# EAGLE design WirelessScale (EAGLE 5.10)
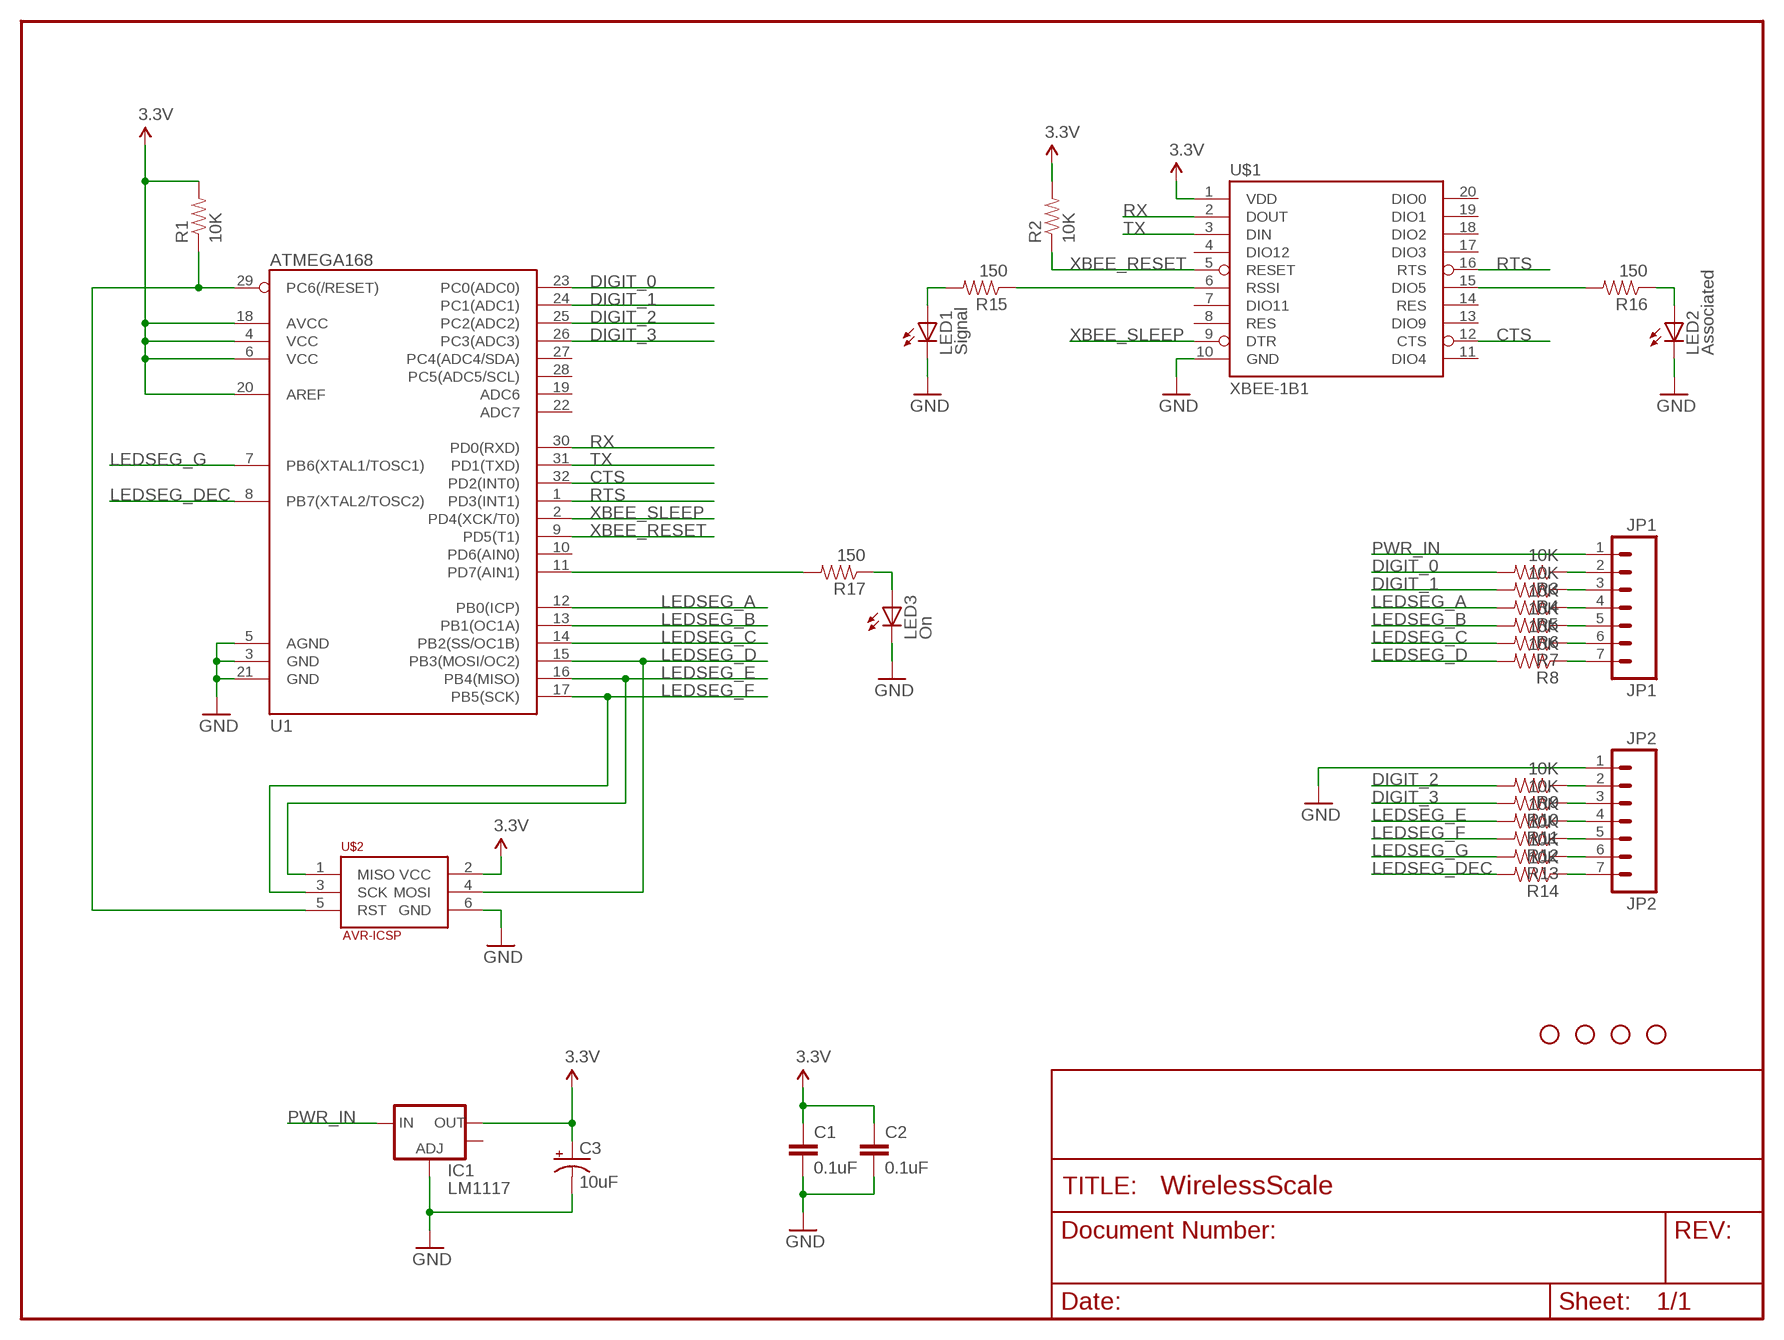
[diagram p0: schematic, sheet 1]

## Parts
C1  0.1uF  CAP1206  [1206]
C2  0.1uF  CAP1206  [1206]
C3  10uF  CAP_POLPTH2  [CPOL-RADIAL-10UF-25V]
IC1  LM1117  V_REG_LM1117SOT223  [SOT223]
JP1  JP1  M07  [1X07]
JP2  JP2  M07  [1X07]
JP3  STAND-OFF  [STAND-OFF]
JP4  STAND-OFF  [STAND-OFF]
JP5  STAND-OFF  [STAND-OFF]
JP6  STAND-OFF  [STAND-OFF]
LED1  Signal  LED1206  [LED-1206]
LED2  Associated  LED1206  [LED-1206]
LED3  On  LED1206  [LED-1206]
R1  10K  RESISTOR1206  [1206]
R2  10K  RESISTOR1206  [1206]
R3  10K  RESISTOR1206  [1206]
R4  10K  RESISTOR1206  [1206]
R5  10K  RESISTOR1206  [1206]
R6  10K  RESISTOR1206  [1206]
R7  10K  RESISTOR1206  [1206]
R8  10K  RESISTOR1206  [1206]
R9  10K  RESISTOR1206  [1206]
R10  10K  RESISTOR1206  [1206]
R11  10K  RESISTOR1206  [1206]
R12  10K  RESISTOR1206  [1206]
R13  10K  RESISTOR1206  [1206]
R14  10K  RESISTOR1206  [1206]
R15  150  RESISTOR1206  [1206]
R16  150  RESISTOR1206  [1206]
R17  150  RESISTOR1206  [1206]
U1  ATMEGA168  [TQFP32-08]
U$1  XBEE-1B1  [XBEE-1]
U$2  AVR-ICSP  [AVR-ICSP]

## Nets
3.3V: C1.1 C2.1 C3.1(+) IC1.2(OUT) R1.2 R2.2 U1.4(VCC) U1.6(VCC) U1.18(AVCC) U1.20(AREF) U$1.1(VDD) U$2.2(VCC)
CTS: U1.32(PD2(INT0)) U$1.12(CTS)
DIGIT_0: R3.2 U1.23(PC0(ADC0))
DIGIT_1: R4.2 U1.24(PC1(ADC1))
DIGIT_2: R9.2 U1.25(PC2(ADC2))
DIGIT_3: R10.2 U1.26(PC3(ADC3))
GND: C1.2 C2.2 C3.2(-) IC1.1(ADJ) JP2.1 LED1.C LED2.C LED3.C U1.3(GND) U1.5(AGND) U1.21(GND) U$1.10(GND) U$2.6(GND)
LEDSEG_A: R5.2 U1.12(PB0(ICP))
LEDSEG_B: R6.2 U1.13(PB1(OC1A))
LEDSEG_C: R7.2 U1.14(PB2(SS/OC1B))
LEDSEG_D: R8.2 U1.15(PB3(MOSI/OC2)) U$2.4(MOSI)
LEDSEG_DEC: R14.2 U1.8(PB7(XTAL2/TOSC2))
LEDSEG_E: R11.2 U1.16(PB4(MISO)) U$2.1(MISO)
LEDSEG_F: R12.2 U1.17(PB5(SCK)) U$2.3(SCK)
LEDSEG_G: R13.2 U1.7(PB6(XTAL1/TOSC1))
N$1: R15.1 U$1.6(RSSI)
N$2: R1.1 U1.29(PC6(/RESET)) U$2.5(RST)
N$3: LED1.A R15.2
N$4: JP2.2 R9.1
N$5: JP2.3 R10.1
N$6: JP2.4 R11.1
N$7: JP2.5 R12.1
N$8: R16.2 U$1.15(DIO5)
N$9: JP2.6 R13.1
N$10: JP2.7 R14.1
N$11: JP1.2 R3.1
N$12: JP1.3 R4.1
N$13: JP1.4 R5.1
N$14: JP1.5 R6.1
N$15: JP1.6 R7.1
N$16: JP1.7 R8.1
N$17: LED2.A R16.1
N$19: LED3.A R17.1
N$20: R17.2 U1.11(PD7(AIN1))
PWR_IN: IC1.3(IN) JP1.1
RTS: U1.1(PD3(INT1)) U$1.16(RTS)
RX: U1.30(PD0(RXD)) U$1.2(DOUT)
TX: U1.31(PD1(TXD)) U$1.3(DIN)
XBEE_RESET: R2.1 U1.9(PD5(T1)) U$1.5(RESET)
XBEE_SLEEP: U1.2(PD4(XCK/T0)) U$1.9(DTR)
Unconnected: IC1.4(OUT) U1.10(PD6(AIN0)) U1.19(ADC6) U1.22(ADC7) U1.27(PC4(ADC4/SDA)) U1.28(PC5(ADC5/SCL)) U$1.4(DIO12) U$1.7(DIO11) U$1.8(RES) U$1.11(DIO4) U$1.13(DIO9) U$1.14(RES) U$1.17(DIO3) U$1.18(DIO2) U$1.19(DIO1) U$1.20(DIO0)

## Library data of the parts
C1 C2 = SparkFun:CAP: Capacitor Standard 0603 ceramic capacitor, and 0.1" leaded capacitor.
C3 = SparkFun:CAP_POL: Capacitor Polarized These are standard SMD and PTH capacitors. Normally 10uF, 47uF, and 100uF in electrolytic and tantalum varieties. Always verify the external diameter of the through hole cap, it varies with capacity, voltage, and manufacturer. The EIA devices should be standard.
IC1 = SparkFun:V_REG_LM1117: Voltage Regulator LM1117 Standard adjustable voltage regulator but in SMD form. Spark Fun Electronics SKU : COM-00595
JP1 JP2 = SparkFun:M07: Header 7 Standard 7-pin 0.1" header. Use with straight break away headers (SKU : PRT-00116), right angle break away headers (PRT-00553), swiss pins (PRT-00743), machine pins (PRT-00117), and female headers (PRT-00115). NOTES ON THE VARIANTS LOCK and LOCK_LONGPADS... This footprint was designed to help hold the alignment of a through-hole component (i.e. 7-pin header) while soldering it into place. You may notice that each hole has been shifted either up or down by 0.005 of an inch from it's more standard position (which is usually a perfectly straight line). This slight alteration caused the pins (the squares in the middle) to touch the edges of the holes. Because they are alternating, it causes a "brace" to hold the header in place. 0.005 has proven to be the perfect amount of "off-center" position when using our standard breakaway headers. Although looks a little odd when you look at the bare footprint, once you have a header in there, the alteration is very hard to notice. Also, if you push a header all the way into place, it is covered up entirely on the bottom side. This idea of altering the position of holes to aid alignment will be further integrated into the Sparkfun Library for other footprints. It can help hold any component with 3 or more connection pins.
JP3-JP6 = SparkFun:STAND-OFF: Stand Off This is the mechanical footprint for a #4 phillips button head screw. Use the keepout ring to avoid running the screw head into surrounding components. SKU : PRT-00447
LED1-LED3 = SparkFun:LED: LEDs Standard schematic elements and footprints for 5mm, 3mm, 1206, and 0603 sized LEDs. 5mm - Spark Fun Electronics SKU : COM-00529 (and others)
R1-R17 = SparkFun:RESISTOR: Resistor Basic schematic elements and footprints for 0603, 1206, and PTH 1/10th watt (small) resistors.
U1 = SparkFun:ATMEGA168
U$1 = SparkFun:XBEE-1
U$2 = FiveVolt:AVR-ICSP

## Board
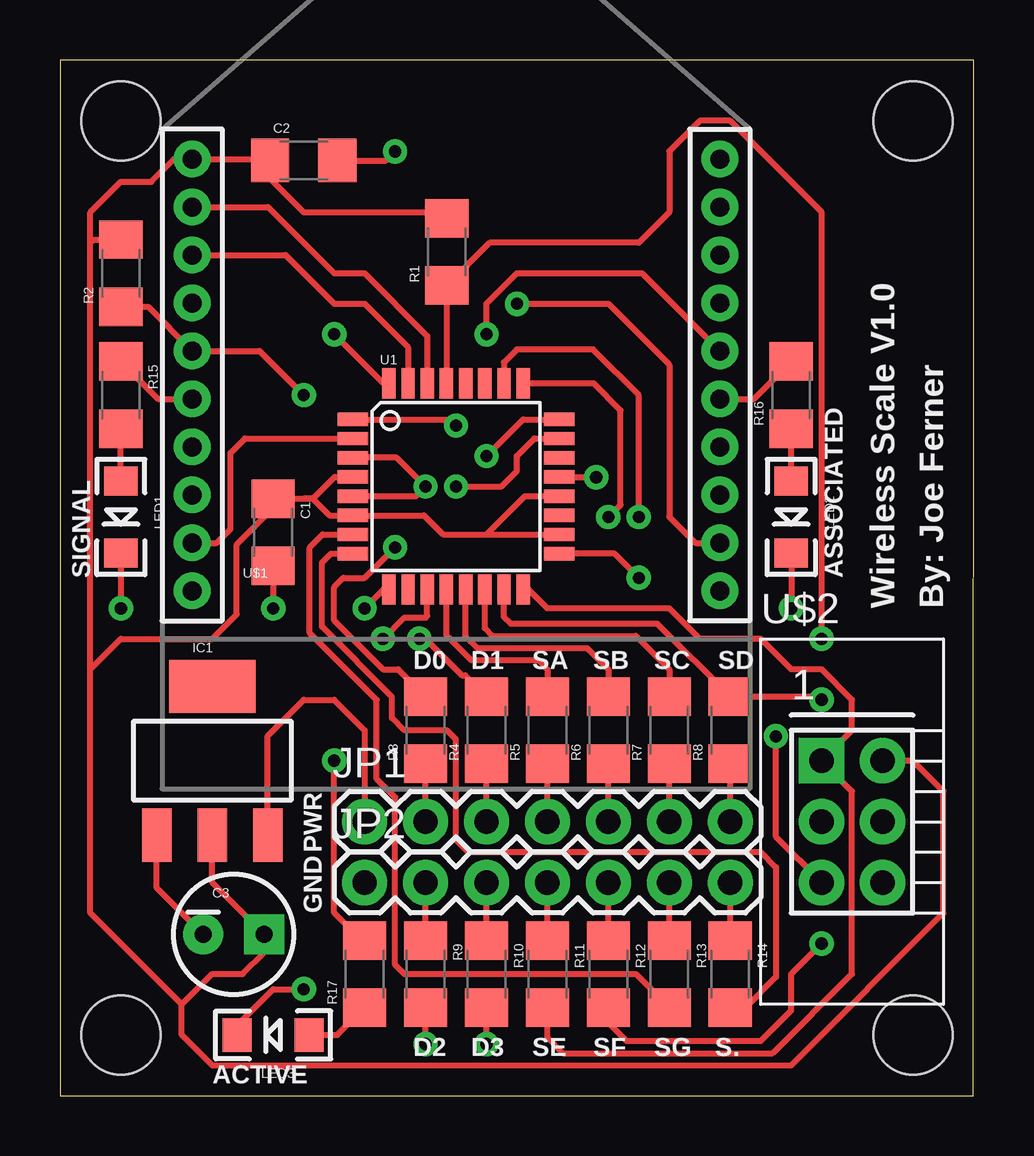
[diagram p1: board, top side]
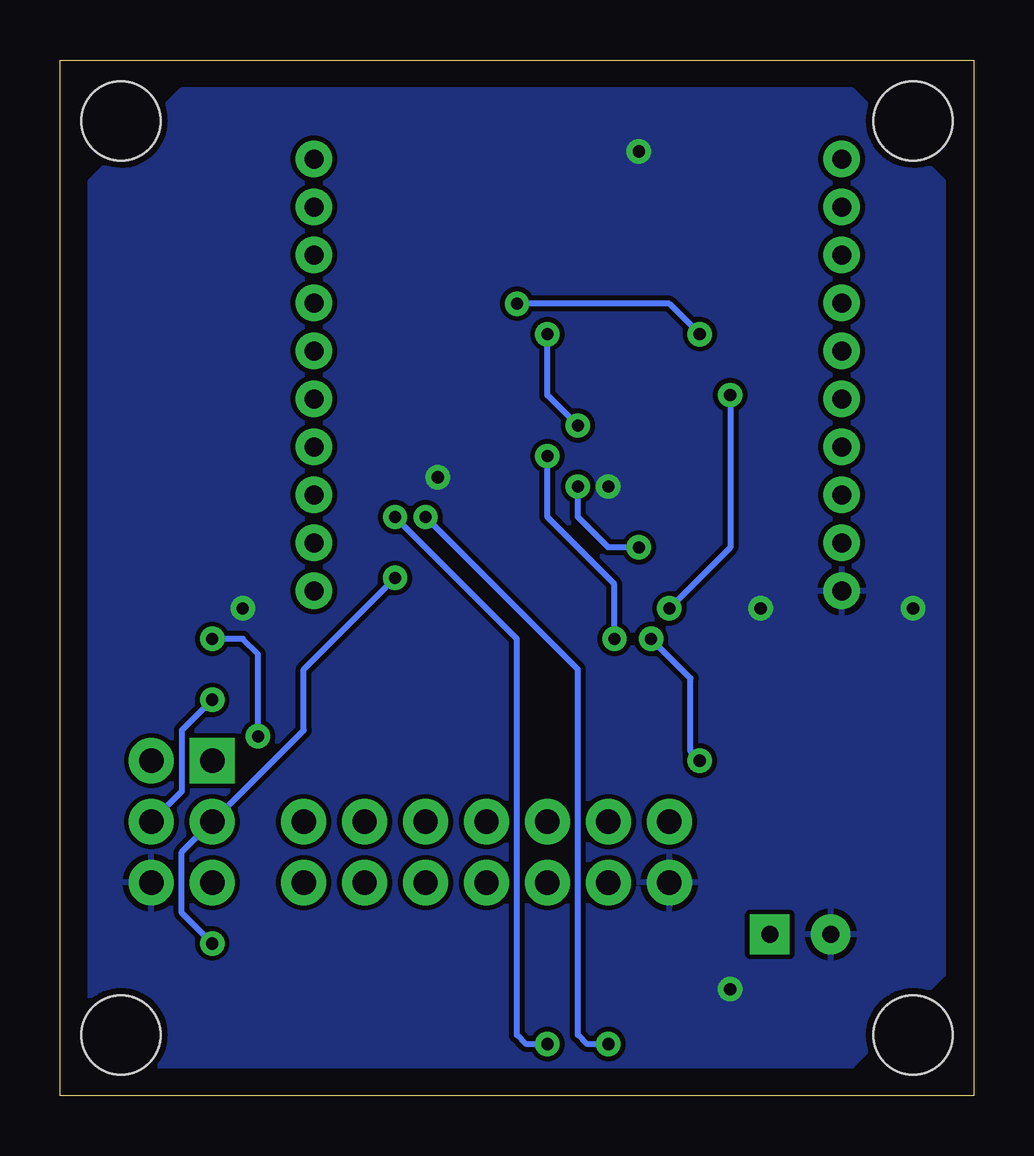
[diagram p2: board, bottom side, seen from below]

Size 38.1 x 43.18 mm. Coordinates in mm from the lower left corner, seen from the top.
Outline: 0,0 38.08,0 38.1,43.18 0,43.18 0,0
Copper layers (1*16): Top 0.035mm / dielectric 1.5mm / Bottom 0.035mm
Design rules "SparkFun": minimum track width 8mil, minimum drill 20mil, track to track 8mil, track to pad 8mil, pad to pad 8mil, via to via 8mil, smd to smd 8mil, copper to edge 10mil, drill to drill 8mil, minimum pad ring 12mil, minimum via ring 10mil, stop-mask expansion 4mil, vias tented up to drill 25mil, thermal gap 10mil

### Footprints (pad centres in the part's own frame; a part is rotated, then mirrored left to right if it is on the bottom)
1206 = smd 1.6 x 1.8: 1 -1.4,0; 2 1.4,0
CPOL-RADIAL-10UF-25V = drill 0.7 pad 1.651 square: 1 1.27,0 | drill 0.7 pad 1.651 round: 2 -1.27,0
SOT223 = smd 1.219 x 2.235: 1 -2.311,-3.099; 2 0,-3.099; 3 2.311,-3.099 | smd 3.6 x 2.2: 4 0,3.099
1X07 = drill 1.016 pad 1.88 round: 1 0,0; 2 2.54,0; 3 5.08,0; 4 7.62,0; 5 10.16,0; 6 12.7,0; 7 15.24,0
STAND-OFF = hole 3.302: 0,0
LED-1206 = smd 1.2 x 1.4: A -1.5,0; C 1.5,0
TQFP32-08 = smd 1.27 x 0.559: 1 -4.293,2.8; 2 -4.293,2; 3 -4.293,1.2; 4 -4.293,0.4; 5 -4.293,-0.4; 6 -4.293,-1.2; 7 -4.293,-2; 8 -4.293,-2.8; 17 4.293,-2.8; 18 4.293,-2; 19 4.293,-1.2; 20 4.293,-0.4; 21 4.293,0.4; 22 4.293,1.2; 23 4.293,2; 24 4.293,2.8 | smd 0.559 x 1.27: 9 -2.8,-4.293; 10 -2,-4.293; 11 -1.2,-4.293; 12 -0.4,-4.293; 13 0.4,-4.293; 14 1.2,-4.293; 15 2,-4.293; 16 2.8,-4.293; 25 2.8,4.293; 26 2,4.293; 27 1.2,4.293; 28 0.4,4.293; 29 -0.4,4.293; 30 -1.2,4.293; 31 -2,4.293; 32 -2.8,4.293
XBEE-1 = drill 0.8 pad 1.524 round: 1 -11,20; 2 -11,18; 3 -11,16; 4 -11,14; 5 -11,12; 6 -11,10; 7 -11,8; 8 -11,6; 9 -11,4; 10 -11,2; 11 11,2; 12 11,4; 13 11,6; 14 11,8; 15 11,10; 16 11,12; 17 11,14; 18 11,16; 19 11,18; 20 11,20
AVR-ICSP = drill 1.016 pad 1.88 square: 1 -1.27,2.54 | drill 1.016 pad 1.88 round: 2 1.27,2.54; 3 -1.27,0; 4 1.27,0; 5 -1.27,-2.54; 6 1.27,-2.54

### Placement (x,y rotation side)
C1  8.89,23.5 270 top
C2  10.16,38.99 0 top
C3  7.24,6.73 0 top
IC1  6.35,13.97 0 top
JP1  12.7,11.43 0 top
JP2  12.7,8.89 0 top
JP3  2.54,40.64 0 top
JP4  35.56,40.64 0 top
JP5  2.54,2.54 0 top
JP6  35.56,2.54 0 top
LED1  2.54,24.13 270 top
LED2  30.48,24.13 270 top
LED3  8.89,2.54 180 top
R1  16.13,35.18 90 top
R2  2.54,34.29 90 top
R3  15.24,15.24 90 top
R4  17.78,15.24 90 top
R5  20.32,15.24 90 top
R6  22.86,15.24 90 top
R7  25.4,15.24 90 top
R8  27.94,15.24 90 top
R9  15.24,5.08 270 top
R10  17.78,5.08 270 top
R11  20.32,5.08 270 top
R12  22.86,5.08 270 top
R13  25.4,5.08 270 top
R14  27.94,5.08 270 top
R15  2.54,29.21 270 top
R16  30.48,29.21 90 top
R17  12.7,5.08 90 top
U1  16.51,25.4 0 top
U$1  16.51,19.05 0 top
U$2  33.02,11.43 0 top

### Tracks (layer width: path | path; a pad name or v marks a point on that pad's centre or on a via)
3.3V
  Top 0.254: U1.4 11.45,25.8 10.54,24.89 | R1.2 15.88,36.83 10.16,36.83 8.76,38.23 C2.1 8.7,39.05 U$1.1 4.76,39.05 3.81,38.1 2.54,38.1 1.27,36.83 1.27,35.56 | 10.54,24.89 C1.1 8.89,24.51 7.37,22.99 7.37,20.07 6.35,19.05 2.54,19.05 1.27,17.78 | 17.78,23.4 15.97,23.4 15.17,24.2 U1.6 11.23,24.2 10.54,24.89 | 17.78,23.4 U1.18 | U1.20 19.38,25 17.78,23.4 | 10.54,24.89 | 10.54,24.89 10.16,24.89 | U$2.2 35.56,13.97 36.83,12.7 36.83,7.62 30.48,1.27 6.35,1.27 5.08,2.54 5.08,3.81 | 1.27,17.78 1.27,7.62 5.08,3.81 | 1.27,17.78 1.27,35.56 | R2.2 1.4,35.69 1.27,35.56 | IC1.2 6.35,8.89 C3.1 8.51,5.97 7.62,5.08 6.35,5.08 5.08,3.81
CTS  (via drill 0.51)
  Top 0.254: U$1.12 26.48,23.05 25.4,24.13 25.4,30.48 22.86,33.02 v19.05,33.02 | U1.32 13.49,29.69 v11.43,31.75
  Bottom 0.254: v19.05,33.02 12.7,33.02 v11.43,31.75
DIGIT_0  (via drill 0.51)
  Top 0.254: 15.11,16.64 R3.2 14.1,17.78 13.46,17.78 11.43,19.81 11.43,21.21 11.81,21.59 12.7,21.59 v13.97,22.86 | v16.51,25.4 18.41,25.4 19.05,26.04 19.05,26.67 19.78,27.4 U1.23
  Bottom 0.254: v13.97,22.86 15.24,22.86 16.51,24.13 v16.51,25.4
DIGIT_1  (via drill 0.51)
  Top 0.254: 17.4,16.64 R4.2 16.89,17.53 16.76,17.53 15.24,19.05 v14.99,19.05 | U1.24 19.31,28.2 v17.78,26.67
  Bottom 0.254: v14.99,19.05 14.99,21.34 17.78,24.13 v17.78,26.67
DIGIT_2  (via drill 0.51)
  Top 0.254: U1.25 22.25,29.69 23.37,28.57 23.37,24.64 v22.86,24.13 | v15.24,2.16 R9.2
  Bottom 0.254: v22.86,24.13 16.51,17.78 16.51,2.54 16.13,2.16 v15.24,2.16
DIGIT_3  (via drill 0.51)
  Top 0.254: U1.26 18.51,30.57 19.05,31.11 22.23,31.11 24.13,29.21 v24.13,24.13 | v17.78,2.16 R10.2
  Bottom 0.254: v24.13,24.13 19.05,19.05 19.05,2.54 18.67,2.16 v17.78,2.16
GND  (via drill 0.51)
  Top 0.254: C1.2 v8.89,20.32 | U1.5 14.84,25 v15.24,25.4 14.04,26.6 U1.3 | C2.2 13.59,38.99 v13.97,39.37 | U1.21 22.33,25.8 v22.35,25.78 | 7.62,2.54 LED3.C 7.39,2.94 8.89,4.45 v10.16,4.45 | LED2.C v30.48,20.32 | LED1.C v2.54,20.32 | IC1.1 4.04,8.66 C3.2
  pour Bottom: 1.27,5.08 1.27,38.1 5.08,41.91 33.02,41.91 36.83,38.1 36.83,3.81 34.29,1.27 5.08,1.27
LEDSEG_A
  Top 0.254: R5.2 20.32,17.78 19.94,18.16 17.14,18.16 16.11,19.2 U1.12
LEDSEG_B
  Top 0.254: U1.13 16.91,19.16 17.4,18.67 21.97,18.67 22.86,17.78 R6.2
LEDSEG_C
  Top 0.254: U1.14 17.71,19.5 18.03,19.18 24,19.18 25.4,17.78 R7.2
LEDSEG_D  (via drill 0.51)
  Top 0.254: U1.15 18.51,19.97 18.8,19.68 24.89,19.68 R8.2 31.62,16.64 v31.75,16.51
  Bottom 0.254: v31.75,16.51 33.02,15.24 33.02,12.7 U$2.4
LEDSEG_DEC
  Top 0.254: R14.2 28.57,3.68 29.84,4.95 29.84,9.53 29.21,10.16 17.02,10.16 16.51,10.67 16.51,14.86 16.13,15.24 14.35,15.24 13.84,15.75 13.84,16.64 10.92,19.56 10.92,22.23 11.3,22.6 U1.8
LEDSEG_E
  Top 0.254: R11.2 20.32,2.41 20.95,1.78 29.72,1.78 33.02,5.08 33.02,12.7 U$2.1 33.02,15.24 33.02,16.51 31.75,17.78 30.48,17.78 29.21,19.05 26.67,19.05 25.4,20.32 20.32,20.32 19.53,21.11 U1.16
LEDSEG_F  (via drill 0.51)
  Top 0.254: R12.2 22.86,3.05 23.62,2.29 29.21,2.29 30.48,3.56 30.48,5.08 v31.75,6.35 | U1.17 23.12,22.6 v24.13,21.59
  Bottom 0.254: v31.75,6.35 33.02,7.62 33.02,10.16 U$2.3 27.94,15.24 27.94,17.78 v24.13,21.59
LEDSEG_G
  Top 0.254: U1.7 10.95,23.4 10.41,22.86 10.41,19.3 13.21,16.51 13.21,13.21 13.97,12.45 13.97,5.46 14.35,5.08 24,5.08 R13.2
N$1
  Top 0.254: U$1.6 4.1,29.05 R15.1
N$2  (via drill 0.51)
  Top 0.254: U1.29 16.11,33.76 R1.1 17.91,35.56 24.13,35.56 25.4,36.83 25.4,39.37 26.67,40.64 27.94,40.64 31.75,36.83 v31.75,19.05 | U$2.5 29.84,10.79 v29.84,14.99
  Bottom 0.254: v29.84,14.99 29.84,18.41 30.48,19.05 v31.75,19.05
N$3
  Top 0.254: LED1.A R15.2
N$4
  Top 0.254: R9.1 JP2.2
N$5
  Top 0.254: R10.1 JP2.3
N$6
  Top 0.254: R11.1 JP2.4
N$7
  Top 0.254: R12.1 JP2.5
N$8
  Top 0.254: U$1.15 28.92,29.05 R16.2
N$9
  Top 0.254: R13.1 JP2.6
N$10
  Top 0.254: R14.1 JP2.7
N$11
  Top 0.254: JP1.2 R3.1
N$12
  Top 0.254: JP1.3 R4.1
N$13
  Top 0.254: JP1.4 R5.1
N$14
  Top 0.254: JP1.5 R6.1
N$15
  Top 0.254: JP1.6 R7.1
N$16
  Top 0.254: JP1.7 R8.1
N$17
  Top 0.254: LED2.A R16.1
N$19
  Top 0.254: LED3.A 11.56,2.54 R17.1
N$20  (via drill 0.51)
  Top 0.254: U1.11 15.31,20.01 15.24,19.94 14.35,19.94 v13.46,19.05 | R17.2 12.57,6.48 11.43,7.62 v11.43,13.97
  Bottom 0.254: v11.43,13.97 11.81,14.35 11.81,17.4 v13.46,19.05
PWR_IN
  Top 0.254: JP1.1 12.7,15.24 11.43,16.51 10.16,16.51 8.66,15.01 IC1.3
RTS  (via drill 0.51)
  Top 0.254: U1.1 16.25,28.2 v16.51,27.94 | v17.78,31.75 17.78,33.02 19.05,34.29 24.27,34.29 U$1.16
  Bottom 0.254: v16.51,27.94 17.78,29.21 v17.78,31.75
RX
  Top 0.254: U$1.2 8.67,37.05 11.43,34.29 12.7,34.29 15.31,31.68 U1.30
TX
  Top 0.254: U$1.3 9.4,35.05 11.43,33.02 12.7,33.02 14.51,31.21 U1.31
XBEE_RESET  (via drill 0.51)
  Top 0.254: R2.1 3.67,32.89 U$1.5 8.32,31.05 v10.16,29.21 | U1.9 13.49,21.11 v12.7,20.32
  Bottom 0.254: v12.7,20.32 10.16,22.86 v10.16,29.21
XBEE_SLEEP
  Top 0.254: U$1.9 6.54,23.05 7.11,23.62 7.11,26.8 7.71,27.4 U1.2

### Text on the board
tPlace: SIGNAL | ASSOCIATED | Wireless Scale V1.0 | By: Joe Ferner | D0 | D1 | SA | SB | SC | SD | PWR | GND | D2 | D3 | SE | SF | SG | S. | ACTIVE